# Altium schematic sheet ZENER.SchDoc
size A4
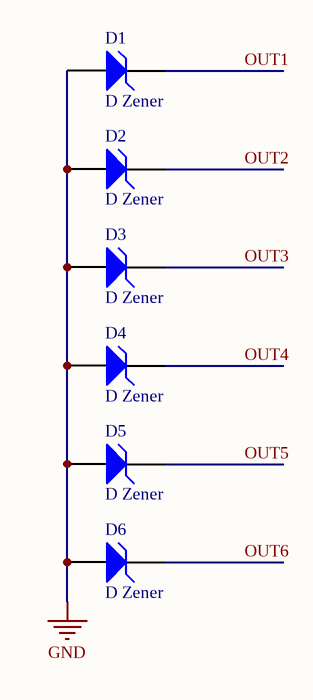
[diagram p0: ZENER.SchDoc]

## Parts
D1  D Zener  [C1206]
D2  D Zener  [C1206]
D3  D Zener  [C1206]
D4  D Zener  [C1206]
D5  D Zener  [C1206]
D6  D Zener  [C1206]

## Nets
GND: D1.1(A) D2.1(A) D3.1(A) D4.1(A) D5.1(A) D6.1(A)
OUT1: D1.2(K)
OUT2: D2.2(K)
OUT3: D3.2(K)
OUT4: D4.2(K)
OUT5: D5.2(K)
OUT6: D6.2(K)

## Library data of the parts
D1-D6 = D Zener: Zener Diode; Published: 8-Jun-2000; LatestRevisionDate: 17-Jul-2002; LatestRevisionNote: Re-released for DXP Platform.; PackageReference: DIODE-0.7; Publisher: Altium Limited; PackageDescription: Diode, Thru-Hole; 2 Leads; 0.7 in Pin Spacing